# EasyEDA Pro project ProPrj_主控板v1.0_2025-02-24.epro, schematic Schematic1

## Sheets
1 MCU及外围电路: Board Name: 底盘板卧插; Create Date: 2024-03-05; Page Name: MCU及外围电路; Project Name: 主控板v1.0; Schematic Name: Schematic1; Update Date: 2024-12-14; Company: 嘉立创EDA; Page Size: A4; Version: V1.0
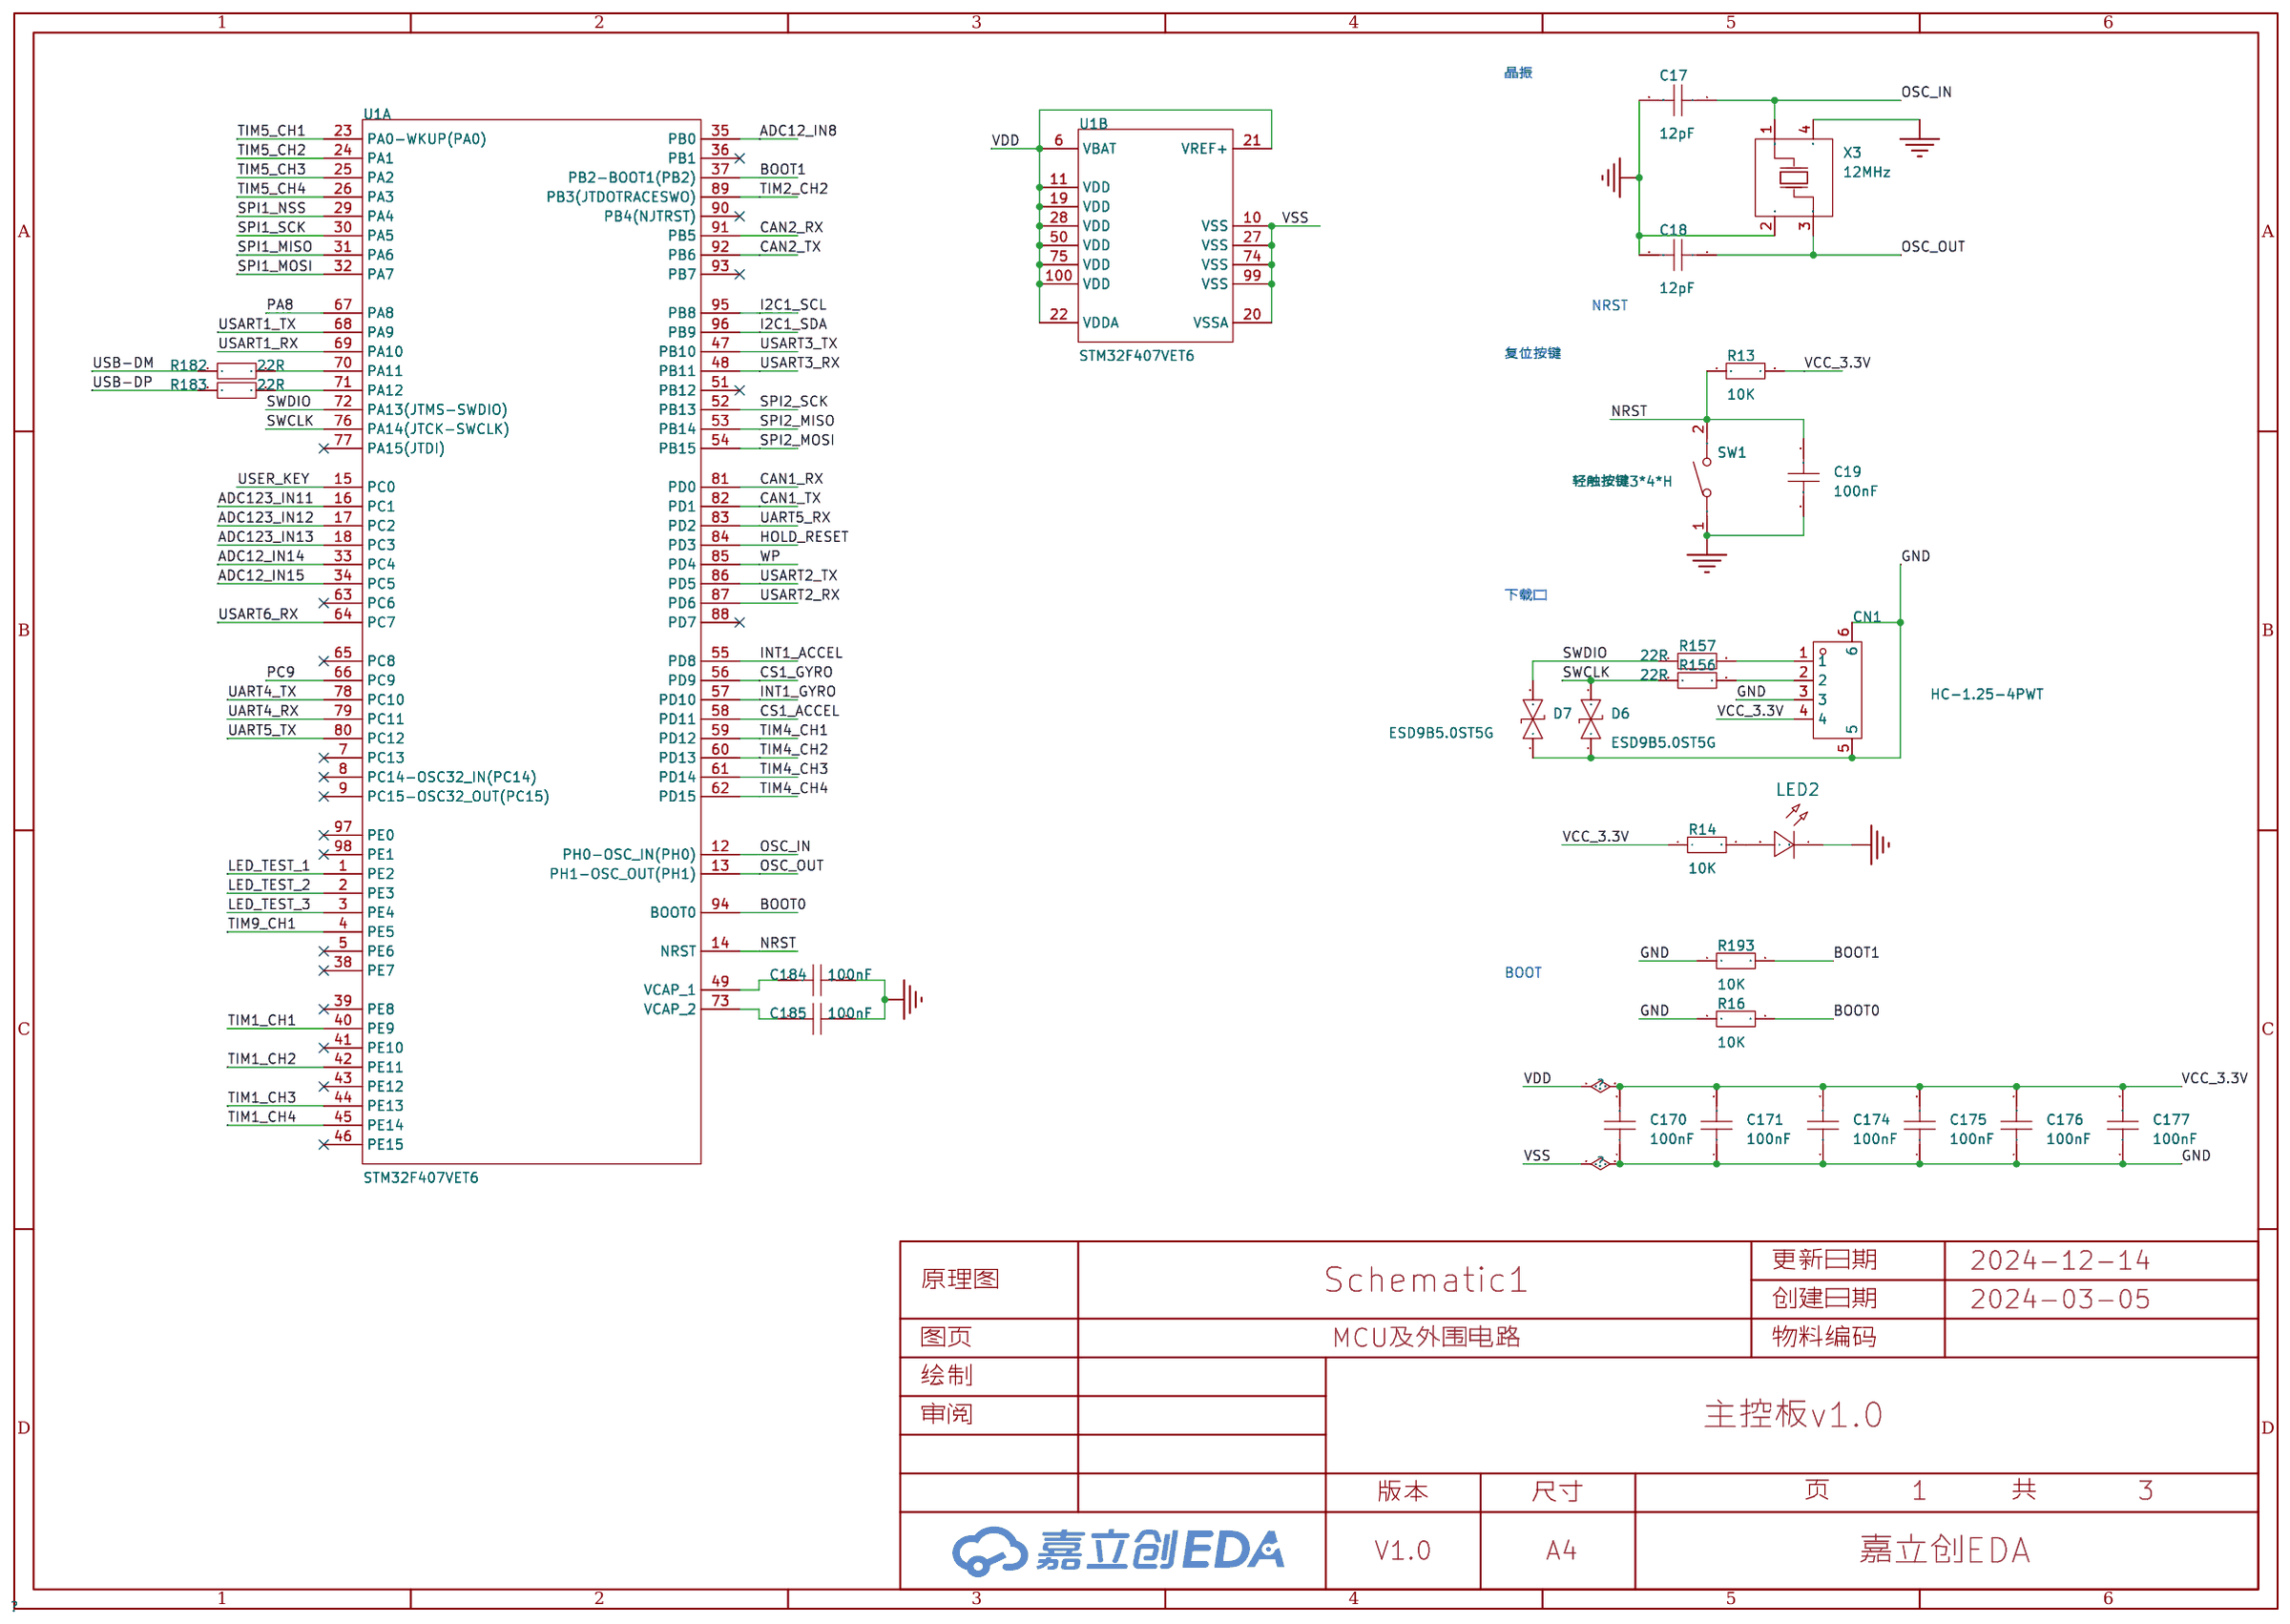
[diagram p0: MCU及外围电路]
2 电源部分: Board Name: 主控板V2.0; Create Date: 2024-03-16; Page Name: 电源部分; Update Date: 2024-12-09
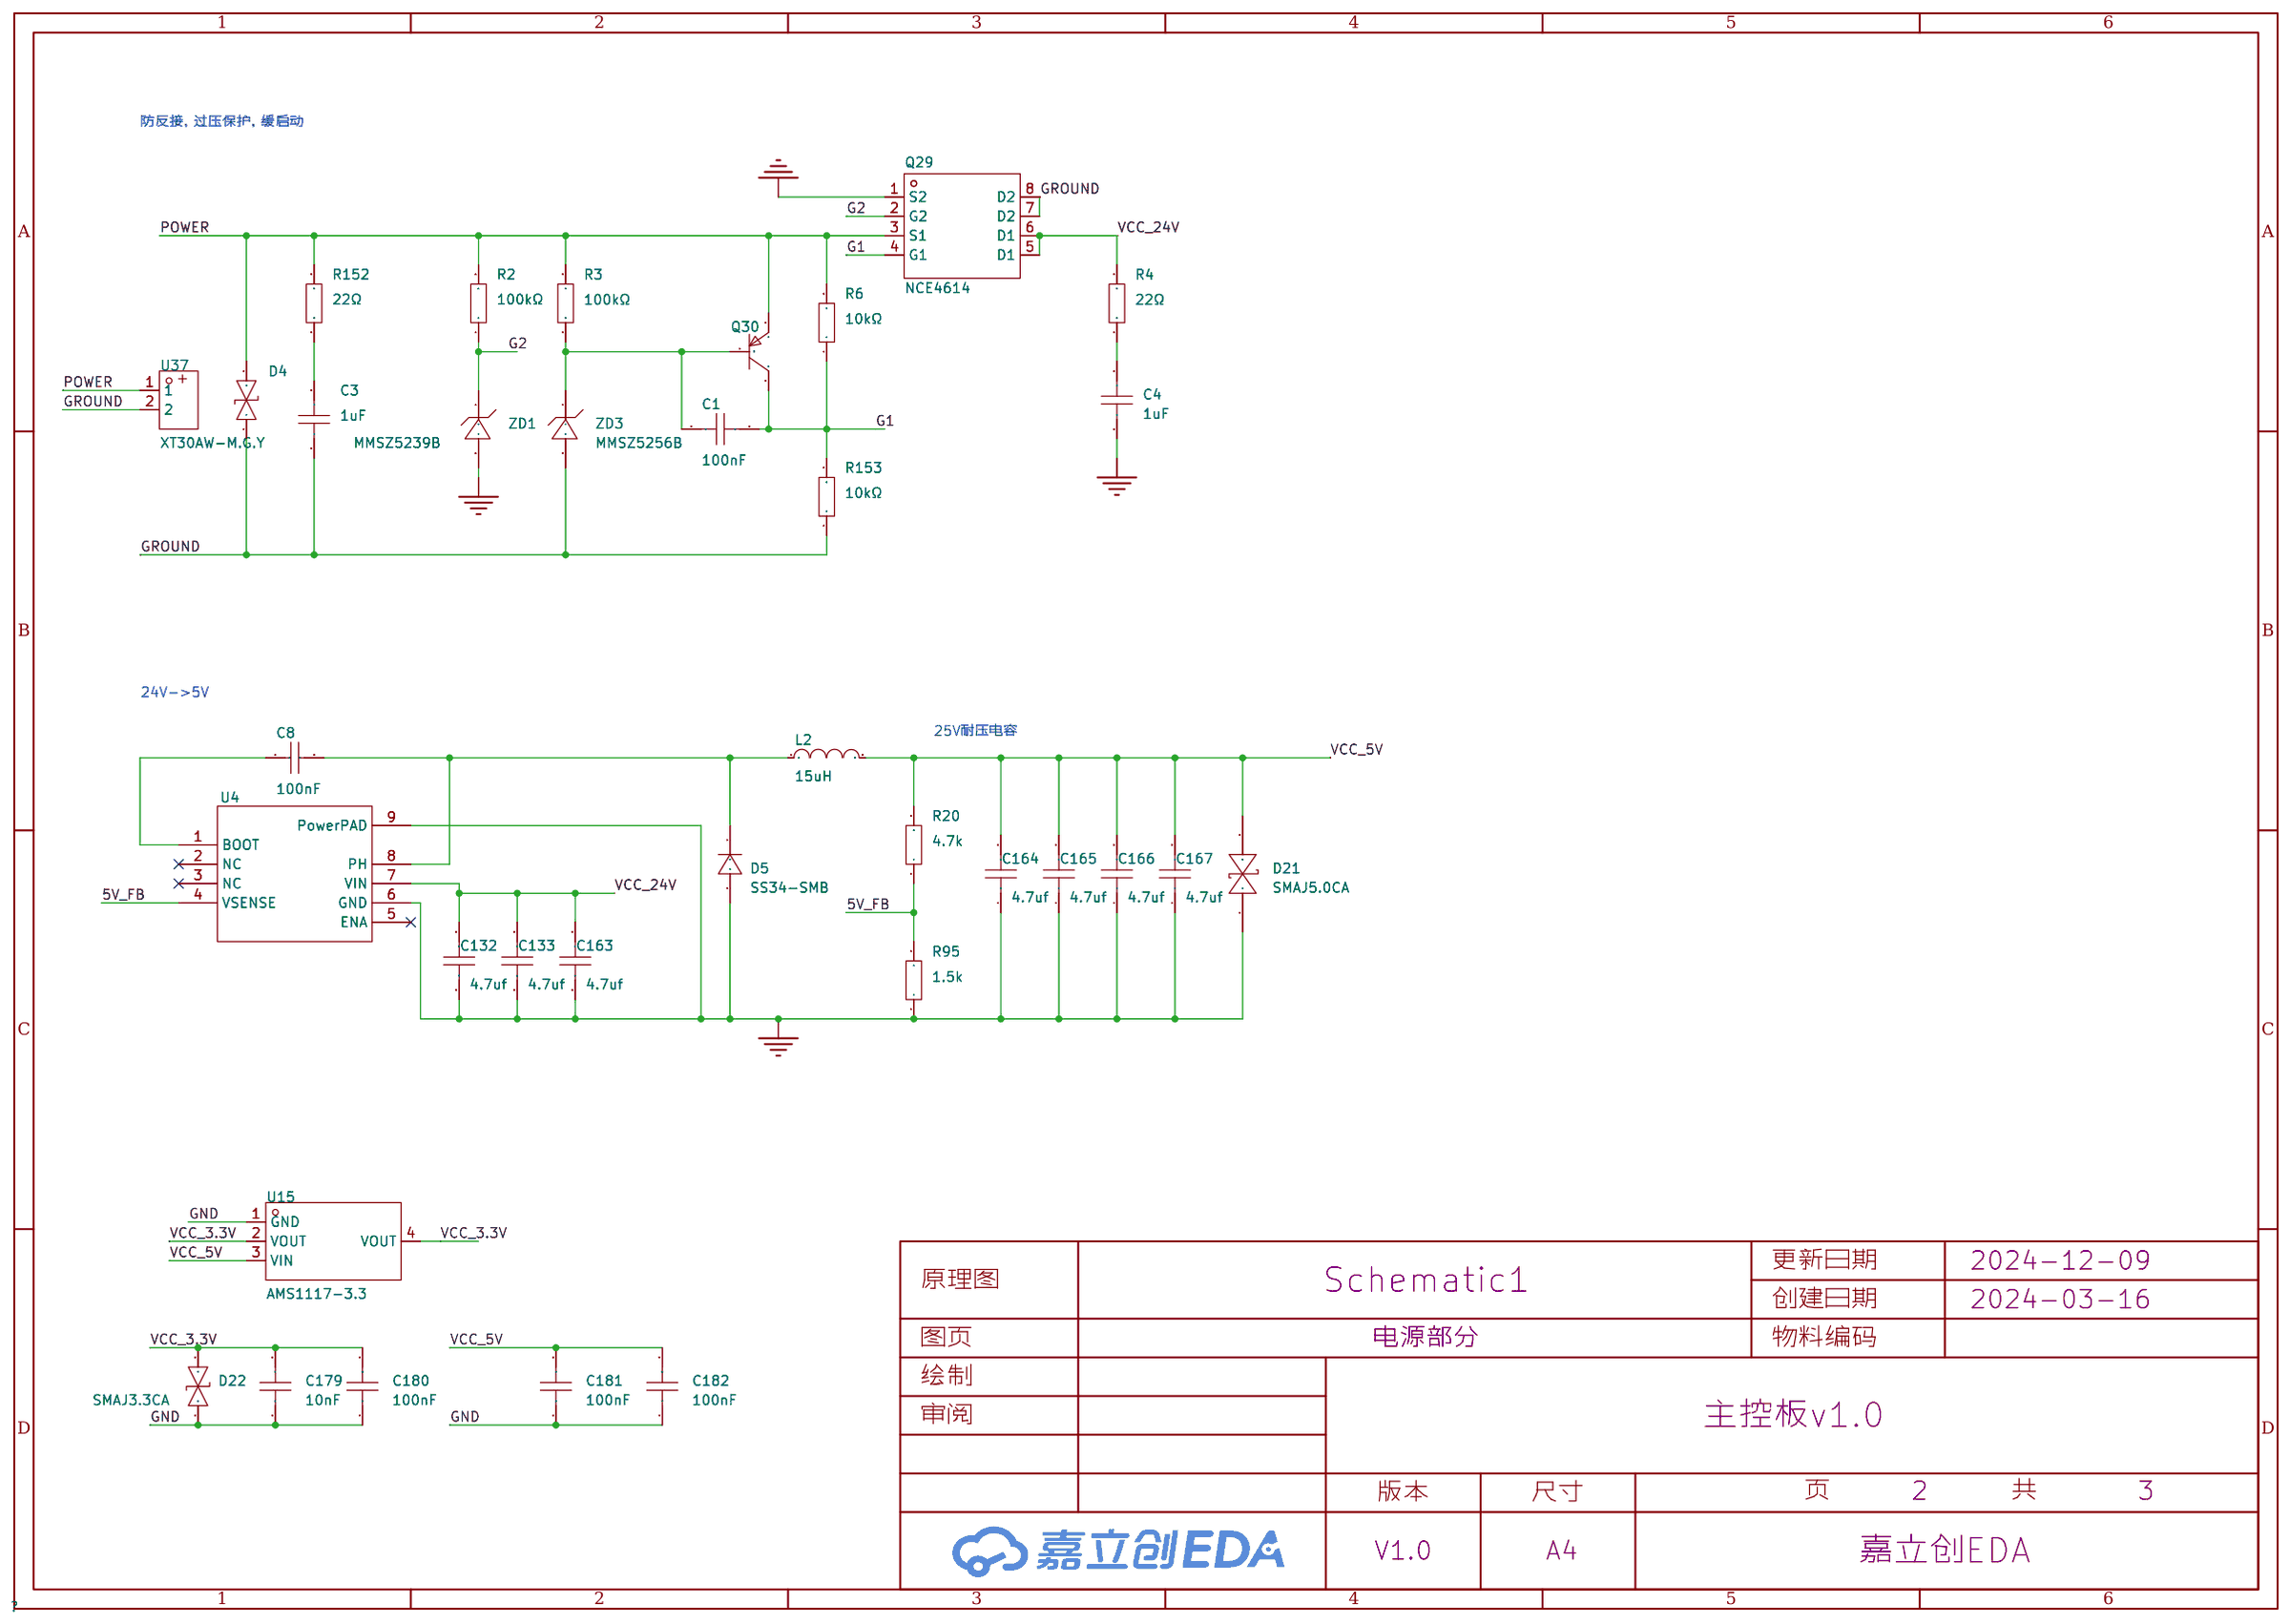
[diagram p1: 电源部分]
3 外部接口: Create Date: 2024-03-16; Page Name: 外部接口; Update Date: 2024-12-09; Page Size: A3
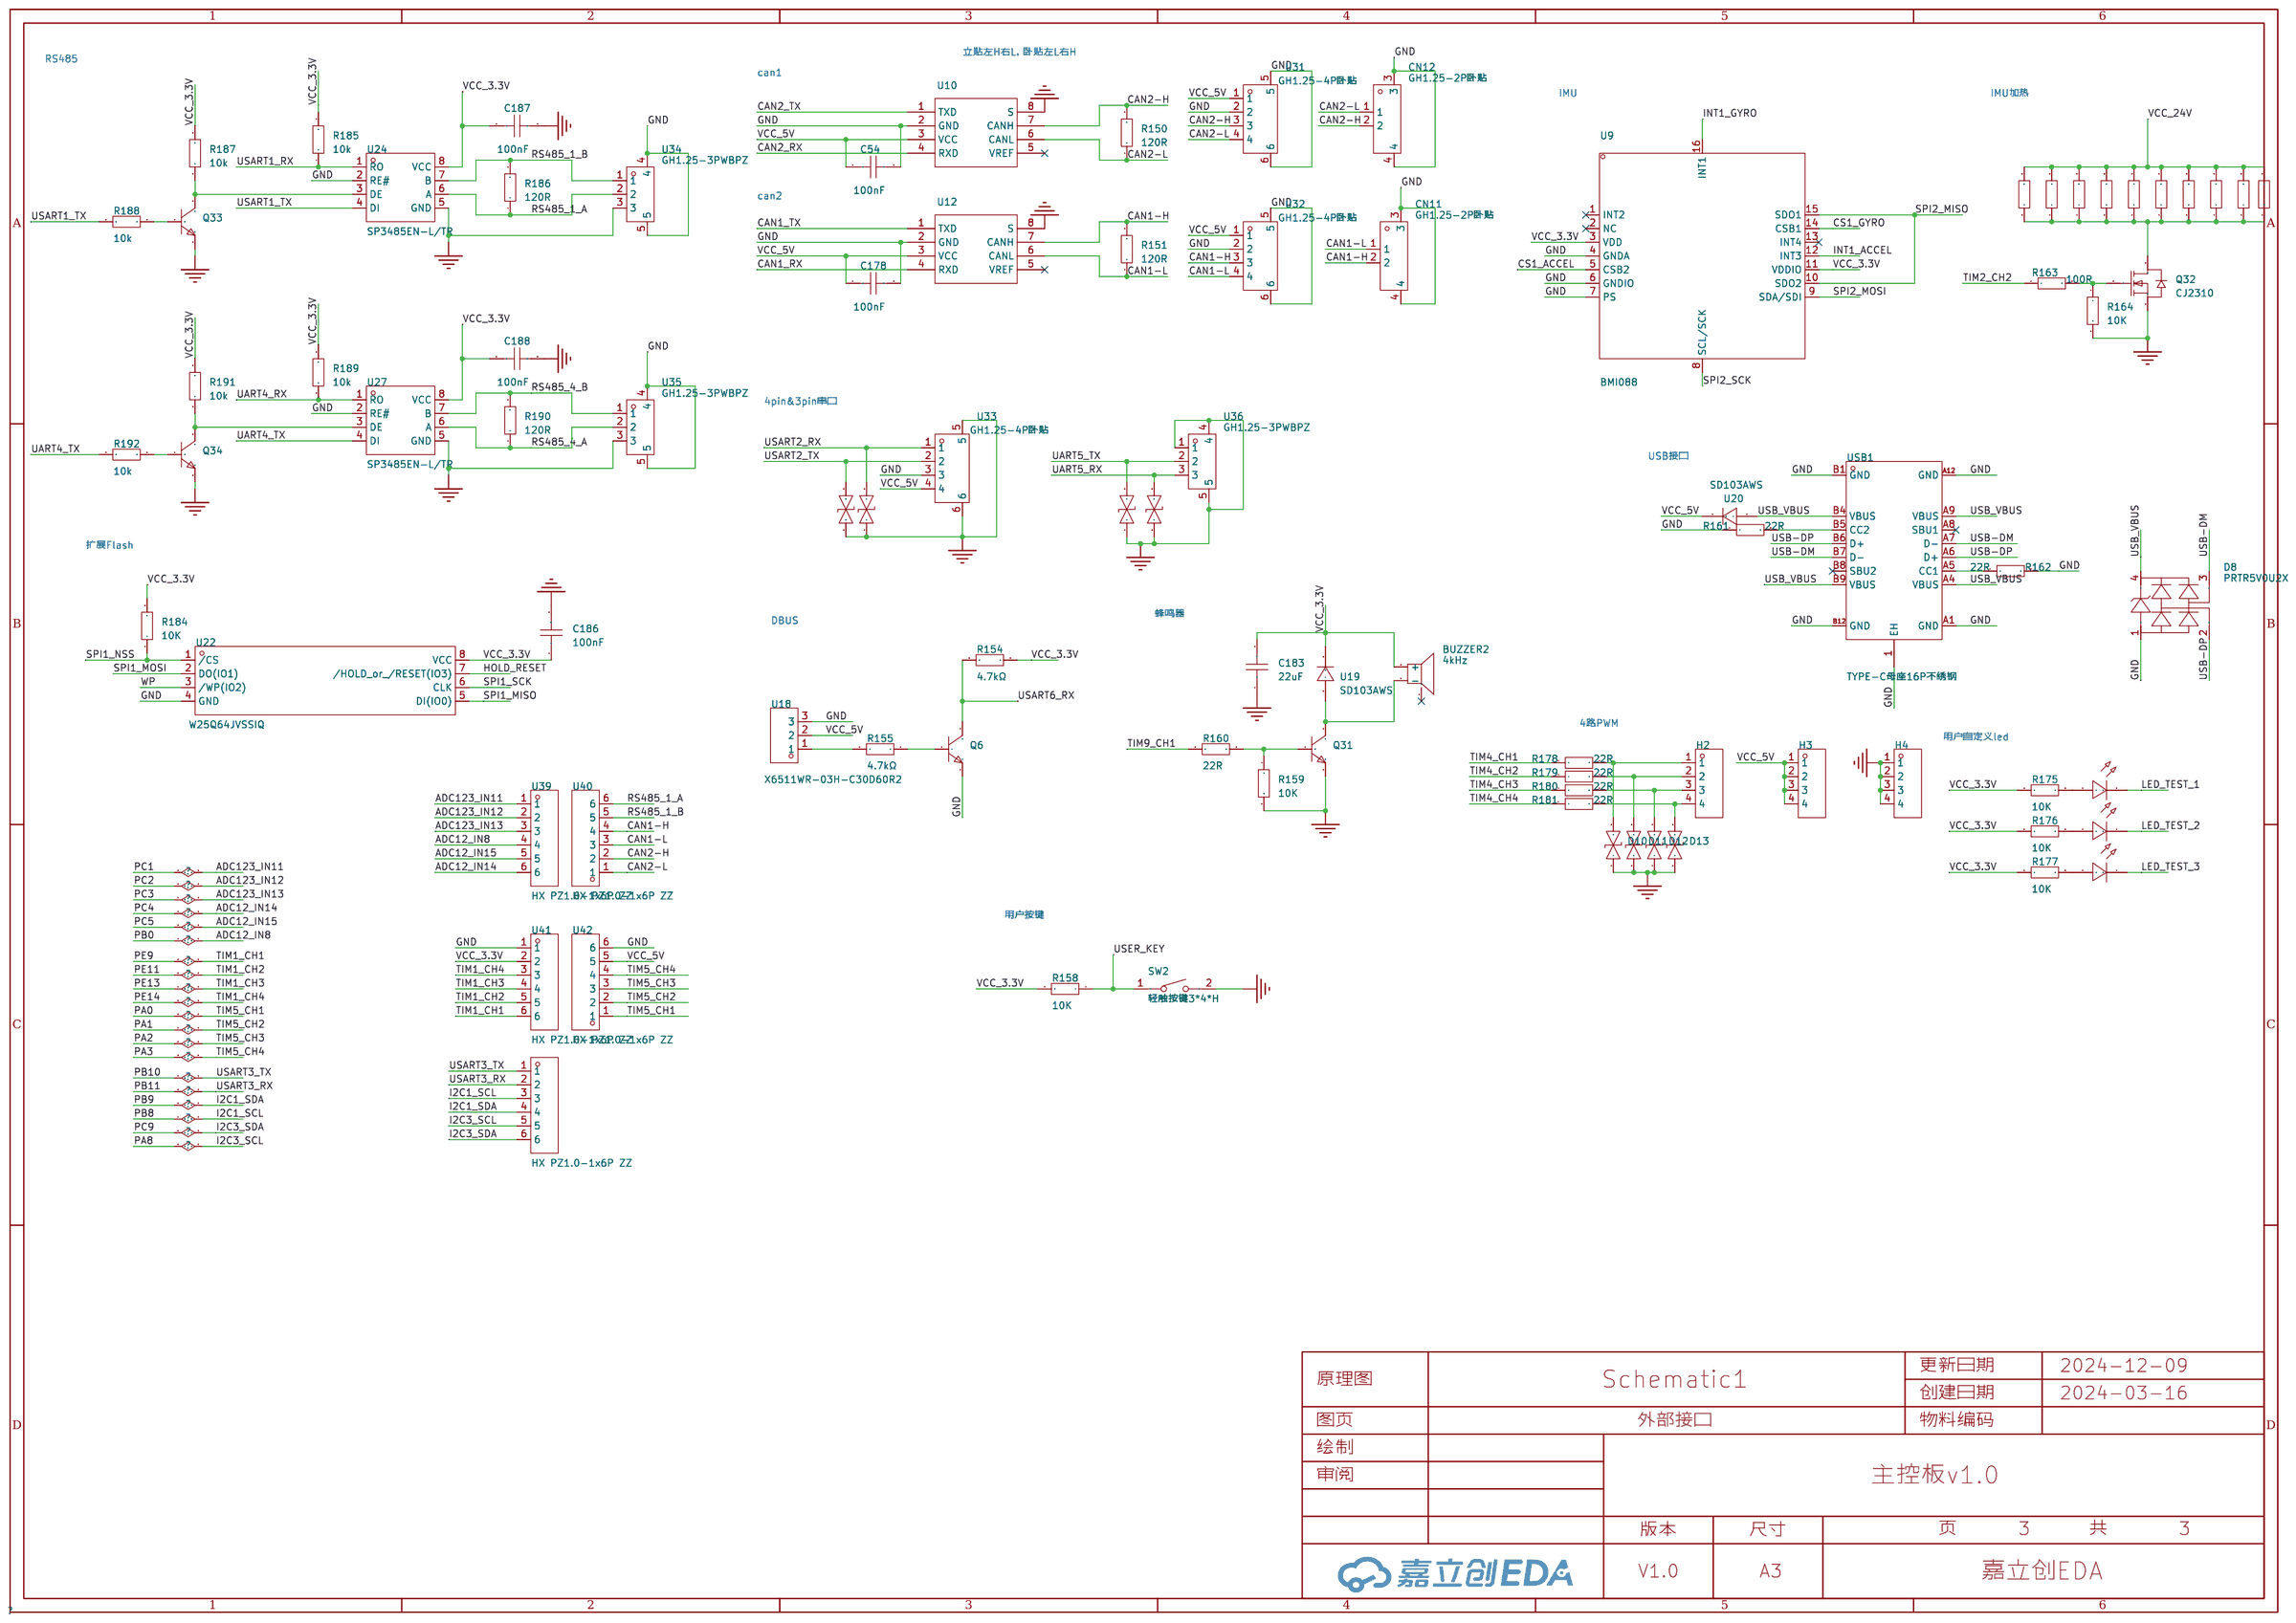
[diagram p2: 外部接口]

## Parts
sheet MCU及外围电路
C17  12pF  [C0603]
C18  12pF  [C0603]
C19  100nF  [C0603]
C170  100nF  [C0603]
C171  100nF  [C0603]
C174  100nF  [C0603]
C175  100nF  [C0603]
C176  100nF  [C0603]
C177  100nF  [C0603]
C184  100nF  [C0603]
C185  100nF  [C0603]
CN1  HC-1.25-4PWT  [CONN-SMD_4P-P1.25-HC-1.25-4PWT]
D6  ESD9B5.0ST5G  [SOD-923_L0.8-W0.6-LS1.0-BI]
D7  ESD9B5.0ST5G  [SOD-923_L0.8-W0.6-LS1.0-BI]
LED2  -  [LED_0603]
R13  10K  [R0603]
R14  10K  [R0603]
R16  10K  [R0603]
R156  22R  [R0603]
R157  22R  [R0603]
R182  22R  [R0603]
R183  22R  [R0603]
R193  10K  [R0603]
SW1  轻触按键3*4*H  [SW-SMD_L4.0-W2.9-LS5.0]
U1  STM32F407VET6  [LQFP-100_L14.0-W14.0-P0.50-LS16.0-BL]  (sections 1,2)
X3  12MHz  [OSC-SMD_4P-L3.2-W2.5-BL]
sheet 外部接口
BUZZER2  4kHz  [BUZ-SMD_L5.0-W5.5-P4.60]
C54  100nF  [C0603]
C178  100nF  [C0603]
C183  22uF  [C0603]
C186  100nF  [C0603]
C187  100nF  [C0603]
C188  100nF  [C0603]
CN11  GH1.25-2P卧贴  [CONN-SMD_2P-P1.25_X1251WRS-02HF-LPSW]
CN12  GH1.25-2P卧贴  [CONN-SMD_2P-P1.25_X1251WRS-02HF-LPSW]
D8  PRTR5V0U2X  [SOT-143-4_L2.9-W1.3-P1.92-LS2.4-BL]
D10  ESD9B5.0ST5G  [SOD-923_L0.8-W0.6-LS1.0-BI]
D11  ESD9B5.0ST5G  [SOD-923_L0.8-W0.6-LS1.0-BI]
D12  ESD9B5.0ST5G  [SOD-923_L0.8-W0.6-LS1.0-BI]
D13  ESD9B5.0ST5G  [SOD-923_L0.8-W0.6-LS1.0-BI]
D19  ESD9B5.0ST5G  [SOD-923_L0.8-W0.6-LS1.0-BI]
D20  ESD9B5.0ST5G  [SOD-923_L0.8-W0.6-LS1.0-BI]
D23  ESD9B5.0ST5G  [SOD-923_L0.8-W0.6-LS1.0-BI]
D24  ESD9B5.0ST5G  [SOD-923_L0.8-W0.6-LS1.0-BI]
H2  -  [HDR-TH_4P-P2.54-V-M]
H3  -  [HDR-TH_4P-P2.54-V-M]
H4  -  [HDR-TH_4P-P2.54-V-M]
LED3  -  [LED_0603]
LED4  -  [LED_0603]
LED5  -  [LED_0603]
Q6  -  [S8050_SOT-23]
Q31  -  [S8050_SOT-23]
Q32  CJ2310  [SOT-23-3_L2.9-W1.6-P1.90-LS2.8-BR]
Q33  -  [S8050_SOT-23]
Q34  -  [S8050_SOT-23]
R150  120R  [R0603]
R151  120R  [R0603]
R154  4.7kΩ  [R0603]
R155  4.7kΩ  [R0603]
R158  10K  [R0603]
R159  10K  [R0603]
R160  22R  [R0603]
R161  22R  [R0603]
R162  22R  [R0603]
R163  100R  [R0603]
R164  10K  [R0603]
R165  470R  [R0402]
R166  470R  [R0402]
R167  470R  [R0402]
R168  470R  [R0402]
R169  470R  [R0402]
R170  470R  [R0402]
R171  470R  [R0402]
R172  470R  [R0402]
R173  470R  [R0402]
R174  470R  [R0402]
R175  10K  [R0603]
R176  10K  [R0603]
R177  10K  [R0603]
R178  22R  [R0603]
R179  22R  [R0603]
R180  22R  [R0603]
R181  22R  [R0603]
R184  10K  [R0603]
R185  10k  [R0603]
R186  120R  [R0603]
R187  10k  [R0603]
R188  10k  [R0603]
R189  10k  [R0603]
R190  120R  [R0603]
R191  10k  [R0603]
R192  10k  [R0603]
SW2  轻触按键3*4*H  [SW-SMD_L4.0-W2.9-LS5.0]
U9  BMI088  [LGA-16_L4.5-W3.0-P0.50-BL]
U10  -  [SOIC-8_L5.0-W4.0-P1.27-LS6.0-BL]
U12  -  [SOIC-8_L5.0-W4.0-P1.27-LS6.0-BL]
U18  X6511WR-03H-C30D60R2  [HDR-TH_3P-P2.54-H-M-W9.7-N]
U19  SD103AWS  [SOD-123_L2.7-W1.7-LS3.8-RD]
U20  SD103AWS  [SOD-123_L2.7-W1.7-LS3.8-RD]
U22  W25Q64JVSSIQ  [SOIC-8_L5.3-W5.3-P1.27-LS8.0-BL]
U24  SP3485EN-L/TR  [SOIC-8_L5.0-W4.0-P1.27-LS6.0-BL]
U27  SP3485EN-L/TR  [SOIC-8_L5.0-W4.0-P1.27-LS6.0-BL]
U31  GH1.25-4P卧贴  [CONN-SMD_4P-P1.25_GH1.25-4P]
U32  GH1.25-4P卧贴  [CONN-SMD_4P-P1.25_GH1.25-4P]
U33  GH1.25-4P卧贴  [CONN-SMD_4P-P1.25_GH1.25-4P]
U34  GH1.25-3PWBPZ  [CONN-SMD_GH1.25-3PWBPZ]
U35  GH1.25-3PWBPZ  [CONN-SMD_GH1.25-3PWBPZ]
U36  GH1.25-3PWBPZ  [CONN-SMD_GH1.25-3PWBPZ]
U38  HX PZ1.0-1x6P ZZ  [HDR-TH_6P-P1.00-V-M]
U39  HX PZ1.0-1x6P ZZ  [HDR-TH_6P-P1.00-V-M]
U40  HX PZ1.0-1x6P ZZ  [HDR-TH_6P-P1.00-V-M]
U41  HX PZ1.0-1x6P ZZ  [HDR-TH_6P-P1.00-V-M]
U42  HX PZ1.0-1x6P ZZ  [HDR-TH_6P-P1.00-V-M]
USB1  TYPE-C母座16P不绣钢  [TYPE-C-SMD_16P-EH4]
sheet 电源部分
C1  100nF  [C0603]
C3  1uF  [C0603]
C4  1uF  [C0603]
C8  100nF  [C0603]
C132  4.7uf  [C0805]
C133  4.7uf  [C0805]
C163  4.7uf  [C0805]
C164  4.7uf  [C0805]
C165  4.7uf  [C0805]
C166  4.7uf  [C0805]
C167  4.7uf  [C0805]
C179  10nF  [C0603]
C180  100nF  [C0603]
C181  100nF  [C0603]
C182  100nF  [C0603]
D4  -  [SMB_L4.6-W3.6-LS5.3-BI]
D5  SS34-SMB  [SMB_L4.4-W3.6-LS5.3-RD]
D21  SMAJ5.0CA  [SMA_L4.4-W2.8-LS5.1-BI]
D22  SMAJ3.3CA  [SMA_L4.3-W2.6-LS5.1-BI]
L2  15uH  [IND-SMD_L6.0-W6.0_SWPA6045S]
Q29  NCE4614  [SOIC-8_L4.9-W3.9-P1.27-LS6.0-BL]
Q30  -  [SOT-23-3_L2.9-W1.3-P1.90-LS2.4-BR]
R2  100kΩ  [R0603]
R3  100kΩ  [R0603]
R4  22Ω  [R0603]
R6  10kΩ  [R0603]
R20  4.7k  [R0603]
R95  1.5k  [R0603]
R152  22Ω  [R0603]
R153  10kΩ  [R0603]
U4  -  [SOIC-8_L5.0-W4.0-P1.27-LS6.0-BL-EP2.0]
U15  AMS1117-3.3  [SOT-223-3_L6.5-W3.4-P2.30-LS7.0-BR]
U37  XT30AW-M.G.Y  [CONN-TH_XT30AW-M.G.Y]
ZD1  MMSZ5239B  [SOD-123_L2.8-W1.8-LS3.7-RD]
ZD3  MMSZ5256B  [SOD-123_L2.8-W1.8-LS3.7-RD]

## Library data of the parts
C17-C19 C170 C171 C174-C177 C179-C186 = CAP_0603: Supplier Footprint: 0603
CN1 = HC-1.25-4PWT: 插针结构:1x4P;间距:1.25mm;安装方式:卧贴;参考系列:-;总PIN数:4P;排数:1;每排PIN数:4;行距:-;额定电流:2A;触头材质:黄铜;触头镀层:锡;工作温度范围:-25℃~+85℃;; LCSC Part Name: 1x4P 间距:1.25mm 卧贴; Supplier Part: C2845381; Manufacturer: HCTL(华灿天禄); Supplier Footprint: SMD,P=1.25mm,卧贴; JLCPCB Part Class: 扩展库; Datasheet: https://atta.szlcsc.com/upload/public/pdf/source/20230707/D26CCCA63A4ED0B68E63A615510D7FF9.pdf; Supplier: LCSC; Pins Structure: 1x4P; Pitch: 1.25mm; Mounting Style: 卧贴; Number of Pins: 4P; Number of Rows: 1; Number of PINs Per Row: 4; Current Rating (Max): 2A; Contact Material: 黄铜; Contact Plating: 锡; Operating Temperature Range: -25℃~+85℃
D6 D7 D10-D13 D19 D20 D23 D24 = ESD9B5.0ST5G: 极性:双向;反向截止电压(Vrwm):5V;最大钳位电压:-;峰值脉冲功率(Ppp)@10/1000us:-;击穿电压:5.8V;; LCSC Part Name: 双向ESD; Supplier Part: C111566; Manufacturer: onsemi(安森美); Supplier Footprint: SOD-923; JLCPCB Part Class: 扩展库; Datasheet: https://atta.szlcsc.com/upload/public/pdf/source/20170704/1499151283092.PDF; Supplier: LCSC; polarity: 双向; Reverse Stand-Off Voltage (Vrwm): 5V; Breakdown Voltage: 5.8V; Number of Lines: 单路; Operating Temperature: -55℃~+150℃@(Tj); Type: ESD
LED2 = LED_0603-R: Supplier Footprint: 0603
R13 R14 R16 R150 R151 R156-R193 = Res_0603: Supplier Footprint: 0603
SW1 SW2 = 轻触按键3*4*H: Supplier Part: C9900017573; Supplier Footprint: 轻触按键3*4*2.5; JLCPCB Part Class: 扩展库; Datasheet: https://atta.szlcsc.comnull; Supplier: LCSC
U1 = STM32F407VET6: CPU内核:CM4;程序存储容量:512KB;RAM总容量:192KB;GPIO端口数量:82;工作电压范围:1.8V~3.6V;CPU最大主频:168MHz;程序存储器类型:FLASH;; Supplier Part: C28730; Manufacturer: ST(意法半导体); Supplier Footprint: LQFP-100(14x14); JLCPCB Part Class: 扩展库; Datasheet: https://atta.szlcsc.com/upload/public/pdf/source/20140801/1457707197138.pdf; Supplier: LCSC; CPU Core: CM4; Program Storage Size: 512KB; RAM Size: 192KB; GPIO Ports Number: 82; Operating Voltage Range: 1.8V~3.6V; CPU Maximum Speed: 168MHz; Program Memory Type: FLASH; Operating Temperature Range: -40℃~+85℃; ADC (Bit): 12bit; DAC (Bit): 12bit; Universal Serial Bus: 有; Peripheral/Function: DMA；LCD/LED驱动；PWM; Watchdog: 有; Infrared Data Association: 有; Low-Voltage Detect: 有; LCD Module: 有; Direct Memory Access: 有; Internal Oscillator: 有
X3 = X322512MSB4SI: 晶振类型:贴片晶振;频率:12MHz;常温频差:±10ppm;外接负载电容:20pF;频率稳定度(全温):±30ppm;; LCSC Part Name: 12MHz ±10ppm 20pF; Supplier Part: C9002; Manufacturer: YXC(扬兴晶振); Supplier Footprint: SMD3225-4P; JLCPCB Part Class: 基础库; Datasheet: https://atta.szlcsc.com/upload/public/pdf/source/20210329/C112971_1F611BDC486E193C1706F6D8EB5AA189.pdf; Supplier: LCSC; Crystal Type: 贴片晶振; Normal temperature Frequency Tolerance: ±10ppm; External load capacitor: 20pF; Frequency Stability(Full temperature range): ±30ppm; Operating Temperature: -40℃~+85℃
BUZZER2 = MLT-5020: 驱动方式:无源(外部驱动);构造类型:电磁式;频率:4kHz;; Supplier Part: C94598; Manufacturer: 华能; Supplier Footprint: SMD,5x5mm; JLCPCB Part Class: 扩展库; Datasheet: https://atta.szlcsc.com/upload/public/pdf/source/20210811/111454390007D221D7259018FB170E62.pdf; Supplier: LCSC; Oscillator Circuit: 无源(外部驱动); Technology Type: 电磁式; Length: 5.2mm; Width: 5.2mm; Height: 2.5mm
C1 C54 C178 C187 C188 = CC0603KRX7R9BB104: 容值:100nF;精度:±10%;额定电压:50V;材质(温度系数):X7R;; LCSC Part Name: 100nF ±10% 50V; Supplier Part: C14663; Manufacturer: YAGEO(国巨); Supplier Footprint: 0603; JLCPCB Part Class: Basic Part; Datasheet: https://atta.szlcsc.com/upload/public/pdf/source/20180910/C282072_33301C7F631E79921B82A8DAC6BCC5B3.pdf; Supplier: LCSC; Tolerance: ±10%; Voltage Rated: 50V; Temperature Coefficient: X7R
CN11 CN12 = GH1.25-2P卧贴_C9900015099: Supplier Part: C9900015099; JLCPCB Part Class: 扩展库; Supplier: LCSC
D8 = PRTR5V0U2X: Supplier Part: C2827688; Manufacturer: TECH PUBLIC(台舟); Supplier Footprint: SOT-143-4; JLCPCB Part Class: 扩展库; Datasheet: https://atta.szlcsc.com/upload/public/pdf/source/20210810/88897AC68D8E670F0742145AB5FD843C.pdf; Supplier: LCSC; Type: ESD
H2-H4 = HDR-M_2.54_1x4P: Supplier Part: C492403; Supplier Footprint: 插件
LED3-LED5 = LED_0603-B: Supplier Footprint: 0603
Q6 Q31 Q33 Q34 = S8050_SOT_NPN: Supplier Footprint: SOT-23
Q32 = CJ2310: 类型:N沟道;漏源电压(Vdss):60V;连续漏极电流(Id):3A;功率(Pd):350mW;导通电阻(RDS(on)@Vgs,Id):105mΩ@10V,3A;阈值电压(Vgs(th)@Id):2V;; LCSC Part Name: N沟道 耐压:60V 电流:3A; Supplier Part: C75882; Manufacturer: CJ(江苏长电/长晶); Supplier Footprint: SOT-23; JLCPCB Part Class: 扩展库; Datasheet: https://atta.szlcsc.com/upload/public/pdf/source/20160713/1468379856997.pdf; Supplier: LCSC; Type: N沟道; Drain Source Voltage (Vdss): 60V; Continuous Drain Current (Id): 3A; Power Dissipation (Pd): 350mW; Drain Source On Resistance (RDS(on)@Vgs,Id): 105mΩ@10V,3A; Gate Threshold Voltage (Vgs(th)@Id): 2V; Total Gate Charge (Qg@Vgs): 6nC; Input Capacitance (Ciss@Vds): 274pF; Reverse Transfer Capacitance (Crss@Vds): 19.5pF
R154 R155 = 0603WAF4701T5E: 电阻类型:厚膜电阻;阻值:4.7kΩ;精度:±1%;功率:100mW;; LCSC Part Name: 4.7kΩ ±1% 100mW; Supplier Part: C23162; Manufacturer: UNI-ROYAL(厚声); Supplier Footprint: 0603; JLCPCB Part Class: Basic Part; Datasheet: https://atta.szlcsc.com/upload/public/pdf/source/20200306/C422600_1E6D84923E4A46A82E41ADD87F860B5C.pdf; Supplier: LCSC; Type: 厚膜电阻; Tolerance: ±1%; Power(Watts): 100mW; Temperature Coefficient: ±100ppm/℃; Overload Voltage (Max): 75V; Operating Temperature Range: -55℃~+155℃
U9 = BMI088: Supplier Part: C194919; Manufacturer: Bosch(博世); Supplier Footprint: LGA-16; JLCPCB Part Class: 扩展库; Datasheet: https://atta.szlcsc.com/upload/public/pdf/source/20180628/C194919_66CCF125FF968C218A4D358C68AC68D6.pdf; Supplier: LCSC
U10 U12 = TJA1050T/CM,118: 类型:收发器;协议类别:CAN总线;; Supplier Part: C6952; Manufacturer: NXP(恩智浦); Supplier Footprint: SOIC-8_150mil; JLCPCB Part Class: Basic Part; Datasheet: https://atta.szlcsc.com/upload/public/pdf/source/20140411/1457707042917.pdf; Supplier: LCSC; Type: 收发器; Protocol: CAN总线; Supply Voltage: 4.75V ~ 5.25V
U18 = X6511WR-03H-C30D60R2: 插针结构:1x3P;间距:2.54mm;行距:2.54mm;圆针/方针:方针;安装类型:直插;排数:单排;总PIN位数:3P;额定电流:3A;额定电压:250V;配合针长度:3mm;塑高:2.5mm;端接针长度:6mm;触头材质:黄铜;触头镀层:金;工作温度范围:-40℃~+105℃;焊接温度(最大值):260℃;颜色:黑色;; LCSC Part Name: 1x3P 间距:2.54mm 方针 直插; Supplier Part: C2883680; Manufacturer: XKB Connection(中国星坤); Supplier Footprint: 弯插,P=2.54mm; JLCPCB Part Class: 扩展库; Datasheet: https://atta.szlcsc.com/upload/public/pdf/source/20211009/B8B41E8C95FDC5FF336AABD5059527B0.pdf; Supplier: LCSC; Pin Structure: 1x3P; Pitch: 2.54mm; Row Spacing: 2.54mm; Circluar Pins/Square Pins: 方针; Mounting Type: 直插; Number of Rows: 单排; Number of Pins: 3P; Current Rating (Max): 3A; Voltage Rating (Max): 250V; Length of Mating Pin: 3mm; Insulation Height: 2.5mm; Length of End Connection Pin: 6mm; Contact Material: 黄铜; Contact Plating: 金; Operating Temperature Range: -40℃~+105℃; Soldering Temperature(Max): 260℃; Color: 黑色
U19 U20 = SD103AWS: Supplier Part: C9900016166; Supplier Footprint: 0805; JLCPCB Part Class: 扩展库; Supplier: LCSC
U22 = W25Q64JVSSIQ_C411338: Supplier Part: C411338; Supplier Footprint: SOIC-8-208mil; JLCPCB Part Class: 扩展库; Supplier: LCSC
U24 U27 = SP3485EN-L/TR: 类型:收发器;数据速率:10Mbps;驱动器/接收器:1/1;; LCSC Part Name: 3.3V供电 10Mbps 收发器; Supplier Part: C8963; Manufacturer: MaxLinear(迈凌); Supplier Footprint: SOIC-8; JLCPCB Part Class: 基础库; Datasheet: https://atta.szlcsc.com/upload/public/pdf/source/20170601/1496285796963.pdf; Supplier: LCSC; Types: 收发器; Supply Voltage: 3.3V; Data Rate: 10Mbps; Driver/receiver: 1/1; Operating Temperature: -40℃~+85℃
U31-U33 = GH1.25-4P卧贴: Supplier Part: C9900014670; JLCPCB Part Class: 扩展库; Supplier: LCSC
U34-U36 = GH1.25-3PWBPZ: LCSC Part Name: GH1.25-3P卧贴编带; Supplier Part: C2829252; Manufacturer: BOOMELE(博穆精密); JLCPCB Part Class: 扩展库; Datasheet: https://atta.szlcsc.com/upload/public/pdf/source/20211125/08A09A4909F58AF780B71FE423A00F7E.pdf; Supplier: LCSC
U38-U42 = HX PZ1.0-1x6P ZZ: 插针结构:1x6P;间距:1mm;行距:-;圆针/方针:方针;安装类型:直插;排数:单排;总PIN位数:6P;额定电流:750mA;额定电压:-;配合针长度:2mm;塑高:1mm;端接针长度:2mm;触头材质:磷青铜;触头镀层:金;工作温度范围:-40℃~+105℃;颜色:黑色;; LCSC Part Name: 1x6P 间距:1mm 方针 直插; Supplier Part: C22438174; Manufacturer: hanxia(韩下); Supplier Footprint: 插件,P=1mm; JLCPCB Part Class: 扩展库; Datasheet: https://atta.szlcsc.com/upload/public/pdf/source/20240522/DE793C8689D5607D09D1F00E564F7D8C.pdf; Supplier: LCSC; Pin Structure: 1x6P; Pitch: 1mm; Circluar Pins/Square Pins: 方针; Mounting Type: 直插; Number of Rows: 单排; Number of Pins: 6P; Current Rating (Max): 750mA; Length of Mating Pin: 2mm; Insulation Height: 1mm; Length of End Connection Pin: 2mm; Contact Material: 磷青铜; Contact Plating: 金; Operating Temperature Range: -40℃~+105℃; Color: 黑色
USB1 = TYPE-C母座16P不绣钢: Supplier Part: C9900003726; Supplier Footprint: TYPE-C-SMD_16P-L8.94-W7.35-P0.50; JLCPCB Part Class: 扩展库; Supplier: LCSC
C3 C4 = CL10A105KB8NNNC: 容值:1uF;精度:±10%;额定电压:50V;材质(温度系数):X5R;; LCSC Part Name: 1uF ±10% 50V; Supplier Part: C15849; Manufacturer: SAMSUNG(三星); Supplier Footprint: 0603; JLCPCB Part Class: Basic Part; Datasheet: https://atta.szlcsc.com/upload/public/pdf/source/20160103/1457707679084.pdf; Supplier: LCSC; Tolerance: ±10%; Voltage Rated: 50V; Temperature Coefficient: X5R
C8 = CAP_0603: 容值:100nF;精度:±10%;额定电压:50V;温度系数:X7R;; Supplier Footprint: 0603
C132 C133 C163-C167 = CAP_0805: Supplier Footprint: 0805
D4 = SMBJ36CA-C114002: Pin Type: IN
D5 = SS34-SMB: 二极管配置:独立式;直流反向耐压(Vr):40V;平均整流电流(Io):3A;正向压降(Vf):550mV@3A;反向电流(Ir):200μA@40V;; LCSC Part Name: 40V 3A 550mV@3A; Supplier Part: C908684; Manufacturer: GOODWORK(固得沃克); Supplier Footprint: SMB; JLCPCB Part Class: Extended Part; Datasheet: https://atta.szlcsc.com/upload/public/pdf/source/20201231/C908684_FEFD3C50E0185A75F65CED4D257977A3.pdf; Supplier: LCSC; Diode Configuration: 独立式; Reverse Voltage (Vr): 40V; Average Rectified Current (Io): 3A; Forward Voltage (Vf@If): 550mV@3A; Reverse Leakage Current (Ir): 200μA@40V
D21 = SMAJ5.0CA: 反向截止电压(Vrwm):5V;最大钳位电压:9.2V;峰值脉冲电流(Ipp)@10/1000us:43.5A;击穿电压:6.4V;; LCSC Part Name: 双向TVS 5V截止 43.5A峰值脉冲; Supplier Part: C356748; Manufacturer: JJW(捷捷微); Supplier Footprint: SMA(DO-214AC); JLCPCB Part Class: 扩展库; Datasheet: https://atta.szlcsc.com/upload/public/pdf/source/20190118/C364660_B64EB57815AD6306F3CC88F8ECD7A3CF.pdf; Supplier: LCSC; Reverse Stand-Off Voltage (Vrwm): 5V; Maximum Clamping Voltage: 9.2V; Peak Pulse Current (Ipp)@10/1000us: 43.5A; Breakdown Voltage: 6.4V; Type: TVS
D22 = SMAJ3.3CA: Supplier Part: C9900005096; Supplier Footprint: SMA; JLCPCB Part Class: 扩展库; Supplier: LCSC
L2 = SWPA6045S150MT: 额定电流:2.05A;精度:±20%;电感值:15uH;直流电阻(DCR):68mΩ;; LCSC Part Name: 15uH ±20%; Supplier Part: C83374; Manufacturer: Sunlord(顺络); Supplier Footprint: SMD; JLCPCB Part Class: Extended Part; Datasheet: https://atta.szlcsc.com/upload/public/pdf/source/20161123/1479873082287.pdf; Supplier: LCSC; Rated Current: 2.05A; Tolerance: ±20%; Length: 6mm; DC Resistance (DCR): 68mΩ; Width: 6mm; Height: 4.5mm
Q29 = NCE4614: 类型:-;漏源电压(Vdss):-;连续漏极电流(Id):-;功率(Pd):-;导通电阻(RDS(on)@Vgs,Id):-;阈值电压(Vgs(th)@Id):-;栅极电荷(Qg@Vgs):-;输入电容(Ciss@Vds):-;反向传输电容(Crss@Vds):-;; Supplier Part: C136092; Manufacturer: NCE(无锡新洁能); Supplier Footprint: SOIC-8; JLCPCB Part Class: 扩展库; Datasheet: https://atta.szlcsc.com/upload/public/pdf/source/20171106/C136092_15099531879911092513.pdf; Supplier: LCSC
Q30 = PMBT3906,235: 晶体管类型:PNP;集射极击穿电压(Vceo):40V;集电极电流(Ic):200mA;功率(Pd):250mW;集电极截止电流(Icbo):50nA;集电极-发射极饱和电压(VCE(sat)@Ic,Ib):400mV@50mA,5mA;直流电流增益(hFE@Ic,Vce):100@10mA,1V;特征频率(fT):250MHz;工作温度:+150℃@(Tj);; LCSC Part Name: PNP40V200mA; Supplier Part: C552713; Manufacturer: Nexperia(安世); Supplier Footprint: SOT-23; JLCPCB Part Class: 扩展库; Datasheet: https://atta.szlcsc.com/upload/public/pdf/source/20200610/C552713_3A9BABDB448860F6CA5CA955E8F05794.pdf; Supplier: LCSC; Transistor Type: PNP; Collector-Emitter Breakdown Voltage (Vceo): 40V; Collector Current (Ic): 200mA; Power Dissipation (Pd): 250mW; Collector Cut-Off Current (Icbo): 50nA; Collector-Emitter Saturation Voltage (VCE(sat)@Ic,Ib): 400mV@50mA,5mA; DC Current Gain (hFE@Ic,Vce): 100@10mA,1V; Transition Frequency (fT): 250MHz; Operating Temperature: +150℃@(Tj)
R2 R3 = 0603WAF1003T5E: 电阻类型:厚膜电阻;阻值:100kΩ;精度:±1%;功率:100mW;; LCSC Part Name: 100kΩ ±1% 100mW; Supplier Part: C25803; Manufacturer: UNI-ROYAL(厚声); Supplier Footprint: 0603; JLCPCB Part Class: Basic Part; Datasheet: https://atta.szlcsc.com/upload/public/pdf/source/20200306/C422600_1E6D84923E4A46A82E41ADD87F860B5C.pdf; Supplier: LCSC; Type: 厚膜电阻; Tolerance: ±1%; Power(Watts): 100mW; Temperature Coefficient: ±100ppm/℃; Overload Voltage (Max): 75V; Operating Temperature Range: -55℃~+155℃
R4 R152 = 0603WAF220JT5E: 电阻类型:厚膜电阻;阻值:22Ω;精度:±1%;功率:100mW;; LCSC Part Name: 22Ω ±1% 100mW; Supplier Part: C23345; Manufacturer: UNI-ROYAL(厚声); Supplier Footprint: 0603; JLCPCB Part Class: Basic Part; Datasheet: https://atta.szlcsc.com/upload/public/pdf/source/20200306/C422600_1E6D84923E4A46A82E41ADD87F860B5C.pdf; Supplier: LCSC; Type: 厚膜电阻; Tolerance: ±1%; Power(Watts): 100mW; Temperature Coefficient: ±100ppm/℃; Overload Voltage (Max): 75V; Operating Temperature Range: -55℃~+155℃
R6 = 0603WAF1001T5E: 电阻类型:厚膜电阻;阻值:1kΩ;精度:±1%;功率:100mW;; LCSC Part Name: 1kΩ ±1% 100mW; Supplier Part: C21190; Manufacturer: UNI-ROYAL(厚声); Supplier Footprint: 0603; JLCPCB Part Class: Basic Part; Datasheet: https://atta.szlcsc.com/upload/public/pdf/source/20200306/C422600_1E6D84923E4A46A82E41ADD87F860B5C.pdf; Supplier: LCSC; Type: 厚膜电阻; Tolerance: ±1%; Power(Watts): 100mW; Temperature Coefficient: ±100ppm/℃; Overload Voltage (Max): 75V; Operating Temperature Range: -55℃~+155℃
R20 = RC0402FR-0740K2L: 电阻类型:厚膜电阻;阻值:40.2kΩ;精度:±1%;功率:62.5mW;; LCSC Part Name: 40.2kΩ ±1% 62.5mW; Supplier Part: C137983; Manufacturer: YAGEO(国巨); Supplier Footprint: 0402; JLCPCB Part Class: Extended Part; Datasheet: https://atta.szlcsc.com/upload/public/pdf/source/20171107/C137983_15100516170371096911.pdf; Supplier: LCSC; Type: 厚膜电阻; Tolerance: ±1%; Power(Watts): 62.5mW; Temperature Coefficient: ±100ppm/℃; Overload Voltage (Max): 50V; Operating Temperature Range: -55℃~+155℃
R95 = RMC 0402 7K68 F N: 阻值:7.68kΩ;精度:±1%;功率:62.5mW;; LCSC Part Name: 7.68kΩ ±1% 62.5mW; Supplier Part: C269406; Manufacturer: Tyohm(幸亚电阻); Supplier Footprint: 0402; JLCPCB Part Class: Extended Part; Datasheet: https://atta.szlcsc.com/upload/public/pdf/source/20190115/C269406_70C6D94631B7472AE456BF703A5A6355.pdf; Supplier: LCSC; Tolerance: ±1%; Power(Watts): 62.5mW
R153 = 0603WAF1002T5E: 电阻类型:厚膜电阻;阻值:10kΩ;精度:±1%;功率:100mW;; LCSC Part Name: 厚膜电阻 10kΩ ±1% 100mW; Supplier Part: C25804; Manufacturer: UNI-ROYAL(厚声); Supplier Footprint: 0603; JLCPCB Part Class: Basic Part; Datasheet: https://atta.szlcsc.com/upload/public/pdf/source/20200306/C422600_1E6D84923E4A46A82E41ADD87F860B5C.pdf; Supplier: LCSC; Type: 厚膜电阻; Tolerance: ±1%; Power(Watts): 100mW; Temperature Coefficient: ±100ppm/℃; Overload Voltage (Max): 75V; Operating Temperature Range: -55℃~+155℃
U4 = TPS5430DDAR: 功能类型:降压型;同步整流:-;输出通道数:-;拓扑结构:-;输入电压:-;输出电流(最大值):-;开关频率:-;; LCSC Part Name: 降压型; Supplier Part: C9864; Manufacturer: TI(德州仪器); Supplier Footprint: SO-8; JLCPCB Part Class: Basic Part; Datasheet: https://atta.szlcsc.com/upload/public/pdf/source/20161207/1481104217724.pdf; Supplier: LCSC; Function: 降压型
U15 = AMS1117-3.3_C6186: 输出类型:固定;最大输入电压:-;输出电压:3.3V;最大输出电流:1A;电源纹波抑制比(PSRR):72dB@(120Hz);输出极性:正极;; LCSC Part Name: 输出3.3V 1A; Supplier Part: C6186; Manufacturer: AMS; Supplier Footprint: SOT-223-3; JLCPCB Part Class: 基础库; Datasheet: https://atta.szlcsc.com/upload/public/pdf/source/20180727/C6186_7A095716F0823C02F1997A905E26C086.pdf; Supplier: LCSC; Output Type: 固定; Output Voltage: 3.3V; MAX Output Current: 1A; Power Supply Rejection Ratio (PSRR): 72dB@(120Hz); Dropout Voltage: 1.3V@(800mA); Output Polarity: 正极; Number of Outputs: 1
U37 = XT30AW-M.G.Y: LCSC Part Name: XT30AW防水锁扣镀金15A二芯公插头; Supplier Part: C19268026; Manufacturer: AMASS(艾迈斯); JLCPCB Part Class: 扩展库; Datasheet: https://atta.szlcsc.com/upload/public/pdf/source/20231221/C234D60309612BC9E76FC24FD9732617.pdf; Supplier: LCSC
ZD1 = MMSZ5239B: 二极管配置:独立式;稳压值(标称值):9.1V;稳压值(范围):8.65V~9.56V;精度:-;功率:350mW;反向电流(Ir):3uA@7V;阻抗(Zzt):10Ω;; LCSC Part Name: 9.1V 350mW 9V1 F4; Supplier Part: C21546; Manufacturer: CJ(江苏长电/长晶); Supplier Footprint: SOD-123; JLCPCB Part Class: Extended Part; Datasheet: https://atta.szlcsc.com/upload/public/pdf/source/20140301/1457707001773.pdf; Supplier: LCSC; Diode Configuration: 独立式; Zener Voltage (Nom): 9.1V; Zener Voltage (Range): 8.65V~9.56V; Power Dissipation: 350mW; Reverse Leakage Current (Ir): 3uA@7V; Zener Impedance (Zzt): 10Ω
ZD3 = MMSZ5256B: 二极管配置:独立式;稳压值(标称值):30V;稳压值(范围):28.5V~31.5V;功率:350mW;精度:-;; Supplier Part: C21539; Manufacturer: CJ(江苏长电/长晶); Supplier Footprint: SOD-123; JLCPCB Part Class: 扩展库; Datasheet: https://atta.szlcsc.com/upload/public/pdf/source/20141125/1457707250015.pdf; Supplier: LCSC; Diode Configuration: 独立式; Zener Voltage (Nom): 30V; Reverse Leakage Current (Ir): 100nA@23V; Zener Voltage (Range): 28.5V~31.5V; Power Dissipation: 350mW; Zener Impedance (Zzt): 49Ω

## Nets
5V_FB: R20.1 R95.2 U4.4(VSENSE)
GND: C4.2 C17.2 C18.2 C19.2 C54.2 C132.1 C133.1 C163.1 C164.1 C165.1 C166.1 C167.1 C170.1 C171.1 C174.1 C175.1 C176.1 C177.1 C178.2 C179.1 C180.1 C181.1 C182.1 C183.1 C184.2 C185.2 C186.2 C187.2 C188.2 CN1.3 CN1.5 CN1.6 CN11.3 CN11.4 CN12.3 CN12.4 D5.2(A) D6.1 D7.1 D8.1 D10.1 D11.1 D12.1 D13.1 D19.1 D20.1 D21.1 D22.1 D23.1 D24.1 H4.1 H4.2 H4.3 H4.4 LED2.1(C) Q6.2 Q29.1(S2) Q31.2 Q32.2(S) Q33.2 Q34.2 R16.1 R95.1 R159.2 R161.1 R162.2 R164.2 R193.1 SW1.1 SW2.2 U1.10(VSS) U1.20(VSSA) U1.27(VSS) U1.74(VSS) U1.99(VSS) U4.6(GND) U4.9(PowerPAD) U9.4(GNDA) U9.6(GNDIO) U9.7(PS) U10.2(GND) U10.8(S) U12.2(GND) U12.8(S) U15.1(GND) U18.3 U22.4(GND) U24.2(RE#) U24.5(GND) U27.2(RE#) U27.5(GND) U31.2 U31.5 U31.6 U32.2 U32.5 U32.6 U33.3 U33.5 U33.6 U34.3 U34.4 U34.5 U35.3 U35.4 U35.5 U36.1 U36.4 U36.5 U41.1 U42.6 USB1.1(EH) USB1.A1(GND) USB1.A12(GND) USB1.B1(GND) USB1.B12(GND) X3.2(GND) X3.4(GND) ZD1.2(A)
VCC_3.3V: BUZZER2.1(+) C170.2 C171.2 C174.2 C175.2 C176.2 C177.2 C179.2 C180.2 C183.2 C186.1 C187.1 C188.1 CN1.4 D22.2 R13.2 R14.1 R154.1 R158.2 R175.1 R176.1 R177.1 R184.2 R185.2 R187.2 R189.2 R191.2 U1.6(VBAT) U1.11(VDD) U1.19(VDD) U1.21(VREF+) U1.22(VDDA) U1.28(VDD) U1.50(VDD) U1.75(VDD) U1.100(VDD) U9.3(VDD) U9.11(VDDIO) U15.2(VOUT) U15.4(VOUT) U19.1(C) U22.8(VCC) U24.8(VCC) U27.8(VCC) U41.2
VCC_5V: C54.1 C164.2 C165.2 C166.2 C167.2 C178.1 C181.2 C182.2 D21.2 H3.1 H3.2 H3.3 H3.4 L2.2 R20.2 U10.3(VCC) U12.3(VCC) U15.3(VIN) U18.2 U20.1(C) U31.1 U32.1 U33.4 U42.5
VCC_24V: C132.2 C133.2 C163.2 Q29.5(D1) Q29.6(D1) R4.2 R165.2 R166.2 R167.2 R168.2 R169.2 R170.2 R171.2 R172.2 R173.2 R174.2 U4.7(VIN)
ADC12_IN8: U1.35(PB0) U39.4
ADC12_IN14: U1.33(PC4) U39.6
ADC12_IN15: U1.34(PC5) U39.5
ADC123_IN11: U1.16(PC1) U39.1
ADC123_IN12: U1.17(PC2) U39.2
ADC123_IN13: U1.18(PC3) U39.3
BOOT0: R16.2 U1.94(BOOT0)
BOOT1: R193.2 U1.37(PB2-BOOT1(PB2))
CAN1-H: CN11.2 R151.2 U12.7(CANH) U32.3 U40.4
CAN1-L: CN11.1 R151.1 U12.6(CANL) U32.4 U40.3
CAN1_RX: U1.81(PD0) U12.4(RXD)
CAN1_TX: U1.82(PD1) U12.1(TXD)
CAN2-H: CN12.2 R150.2 U10.7(CANH) U31.3 U40.2
CAN2-L: CN12.1 R150.1 U10.6(CANL) U31.4 U40.1
CAN2_RX: U1.91(PB5) U10.4(RXD)
CAN2_TX: U1.92(PB6) U10.1(TXD)
CS1_ACCEL: U1.58(PD11) U9.5(CSB2)
CS1_GYRO: U1.56(PD9) U9.14(CSB1)
G1: C1.2 Q29.4(G1) Q30.3(C) R6.1 R153.2
G2: Q29.2(G2) R2.1 ZD1.1(K)
GROUND: C3.1 D4.1 Q29.7(D2) Q29.8(D2) R153.1 U37.2 ZD3.2(A)
HOLD_RESET: U1.84(PD3) U22.7(/HOLD or /RESET(IO3))
I2C1_SCL: U1.95(PB8) U38.3
I2C1_SDA: U1.96(PB9) U38.4
I2C3_SCL: U1.67(PA8) U38.5
I2C3_SDA: U1.66(PC9) U38.6
INT1_ACCEL: U1.55(PD8) U9.12(INT3)
INT1_GYRO: U1.57(PD10) U9.16(INT1)
LED_TEST_1: LED3.1(C) U1.1(PE2)
LED_TEST_2: LED4.1(C) U1.2(PE3)
LED_TEST_3: LED5.1(C) U1.3(PE4)
NRST: C19.1 R13.1 SW1.2 U1.14(NRST)
OSC_IN: C17.1 U1.12(PH0-OSC_IN(PH0)) X3.1(OSC1)
OSC_OUT: C18.1 U1.13(PH1-OSC_OUT(PH1)) X3.3(OSC2)
PA0: U1.23(PA0-WKUP(PA0)) U42.1
PA1: U1.24(PA1) U42.2
PA2: U1.25(PA2) U42.3
PA3: U1.26(PA3) U42.4
PB10: U1.47(PB10) U38.1
PB11: U1.48(PB11) U38.2
PE9: U1.40(PE9) U41.6
PE11: U1.42(PE11) U41.5
PE13: U1.44(PE13) U41.4
PE14: U1.45(PE14) U41.3
POWER: D4.2 Q29.3(S1) Q30.2(E) R2.2 R3.2 R6.2 R152.2 U37.1
RS485_1_A: R186.1 U24.6(A) U34.2 U40.6
RS485_1_B: R186.2 U24.7(B) U34.1 U40.5
RS485_4_A: R190.1 U27.6(A) U35.2
RS485_4_B: R190.2 U27.7(B) U35.1
SPI1_MISO: U1.31(PA6) U22.5(DI(IO0))
SPI1_MOSI: U1.32(PA7) U22.2(DO(IO1))
SPI1_NSS: R184.1 U1.29(PA4) U22.1(/CS)
SPI1_SCK: U1.30(PA5) U22.6(CLK)
SPI2_MISO: U1.53(PB14) U9.10(SDO2) U9.15(SDO1)
SPI2_MOSI: U1.54(PB15) U9.9(SDA/SDI)
SPI2_SCK: U1.52(PB13) U9.8(SCL/SCK)
SWCLK: D6.2 R156.1 U1.76(PA14(JTCK-SWCLK))
SWDIO: D7.2 R157.1 U1.72(PA13(JTMS-SWDIO))
TIM2_CH2: R163.1 U1.89(PB3(JTDOTRACESWO))
TIM4_CH1: R178.1 U1.59(PD12)
TIM4_CH2: R179.1 U1.60(PD13)
TIM4_CH3: R180.1 U1.61(PD14)
TIM4_CH4: R181.1 U1.62(PD15)
TIM9_CH1: R160.1 U1.4(PE5)
UART4_RX: R189.1 U1.79(PC11) U27.1(RO)
UART4_TX: R192.2 U1.78(PC10) U27.4(DI)
UART5_RX: D19.2 U1.83(PD2) U36.3
UART5_TX: D20.2 U1.80(PC12) U36.2
USART1_RX: R185.1 U1.69(PA10) U24.1(RO)
USART1_TX: R188.2 U1.68(PA9) U24.4(DI)
USART2_RX: D23.2 U1.87(PD6) U33.1
USART2_TX: D24.2 U1.86(PD5) U33.2
USART6_RX: Q6.3 R154.2 U1.64(PC7)
USB-DM: D8.3 R182.1 USB1.A7(D-) USB1.B7(D-)
USB-DP: D8.2 R183.1 USB1.A6(D+) USB1.B6(D+)
USB_VBUS: D8.4 U20.2(A) USB1.A4(VBUS) USB1.A9(VBUS) USB1.B4(VBUS) USB1.B9(VBUS)
USER_KEY: R158.1 SW2.1 U1.15(PC0)
WP: U1.85(PD4) U22.3(/WP(IO2))
$1N2558: LED2.2(A) R14.2
$1N3908: C184.1 U1.49(VCAP_1)
$1N3911: C185.1 U1.73(VCAP_2)
$1N10722: CN1.1 R157.2
$1N10751: CN1.2 R156.2
$1N15439: R182.2 U1.70(PA11)
$1N15440: R183.2 U1.71(PA12)
$2N1752: C3.2 R152.1
$2N1755: C4.1 R4.1
$2N1757: C1.1 Q30.1(B) R3.1 ZD3.1(K)
$2N2663: C8.1 U4.1(BOOT)
$2N2664: C8.2 D5.1(C) L2.1 U4.8(PH)
$3N1653: Q6.1 R155.1
$3N1654: R155.2 U18.1
$3N2642: BUZZER2.2(-) Q31.3 U19.2(A)
$3N2793: Q31.1 R159.1 R160.2
$3N2963: R162.1 USB1.A5(CC1)
$3N2969: R161.2 USB1.B5(CC2)
$3N3573: Q32.1(G) R163.2 R164.1
$3N3908: Q32.3(D) R165.1 R166.1 R167.1 R168.1 R169.1 R170.1 R171.1 R172.1 R173.1 R174.1
$3N4093: LED3.2(A) R175.2
$3N4149: LED4.2(A) R176.2
$3N4204: LED5.2(A) R177.2
$3N4509: D10.2 H2.1 R178.2
$3N4516: D11.2 H2.2 R179.2
$3N4547: D12.2 H2.3 R180.2
$3N4554: D13.2 H2.4 R181.2
$3N10667: Q33.1 R188.1
$3N10700: Q33.3 R187.1 U24.3(DE)
$3N11131: Q34.1 R192.1
$3N11141: Q34.3 R191.1 U27.3(DE)

Not connected (* = marked no-connect by the designer): BUZZER2 3(NC)*; U1 5(PE6)* 7(PC13)* 8(PC14-OSC32_IN(PC14))* 9(PC15-OSC32_OUT(PC15))* 36(PB1)* 38(PE7)* 39(PE8)* 41(PE10)* 43(PE12)* 46(PE15)* 51(PB12)* 63(PC6)* 65(PC8)* 77(PA15(JTDI))* 88(PD7)* 90(PB4(NJTRST))* 93(PB7)* 97(PE0)* 98(PE1)*; U4 2(NC)* 3(NC)* 5(ENA)*; U9 1(INT2)* 2(NC)* 13(INT4)*; U10 5(VREF)*; U12 5(VREF)*; USB1 A8(SBU1)* B8(SBU2)*

## Notes on the sheets
sheet 1
- 晶振
- NRST
- 复位按键
- 下载口
- BOOT
sheet 2
- 防反接，过压保护，缓启动
- 24V->5V
- 25V耐压电容
sheet 3
- RS485
- 立贴左H右L，卧贴左L右H
- can1
- IMU
- IMU加热
- can2
- 4pin&3pin串口
- USB接口
- 扩展Flash
- DBUS
- 蜂鸣器
- 4路PWM
- 用户自定义led
- 用户按键
